# Altium schematic sheet GZ7_1_x-POWER.SchDoc: GZ8-4-0
size B; SheetNumber: 5; SheetTotal: 9
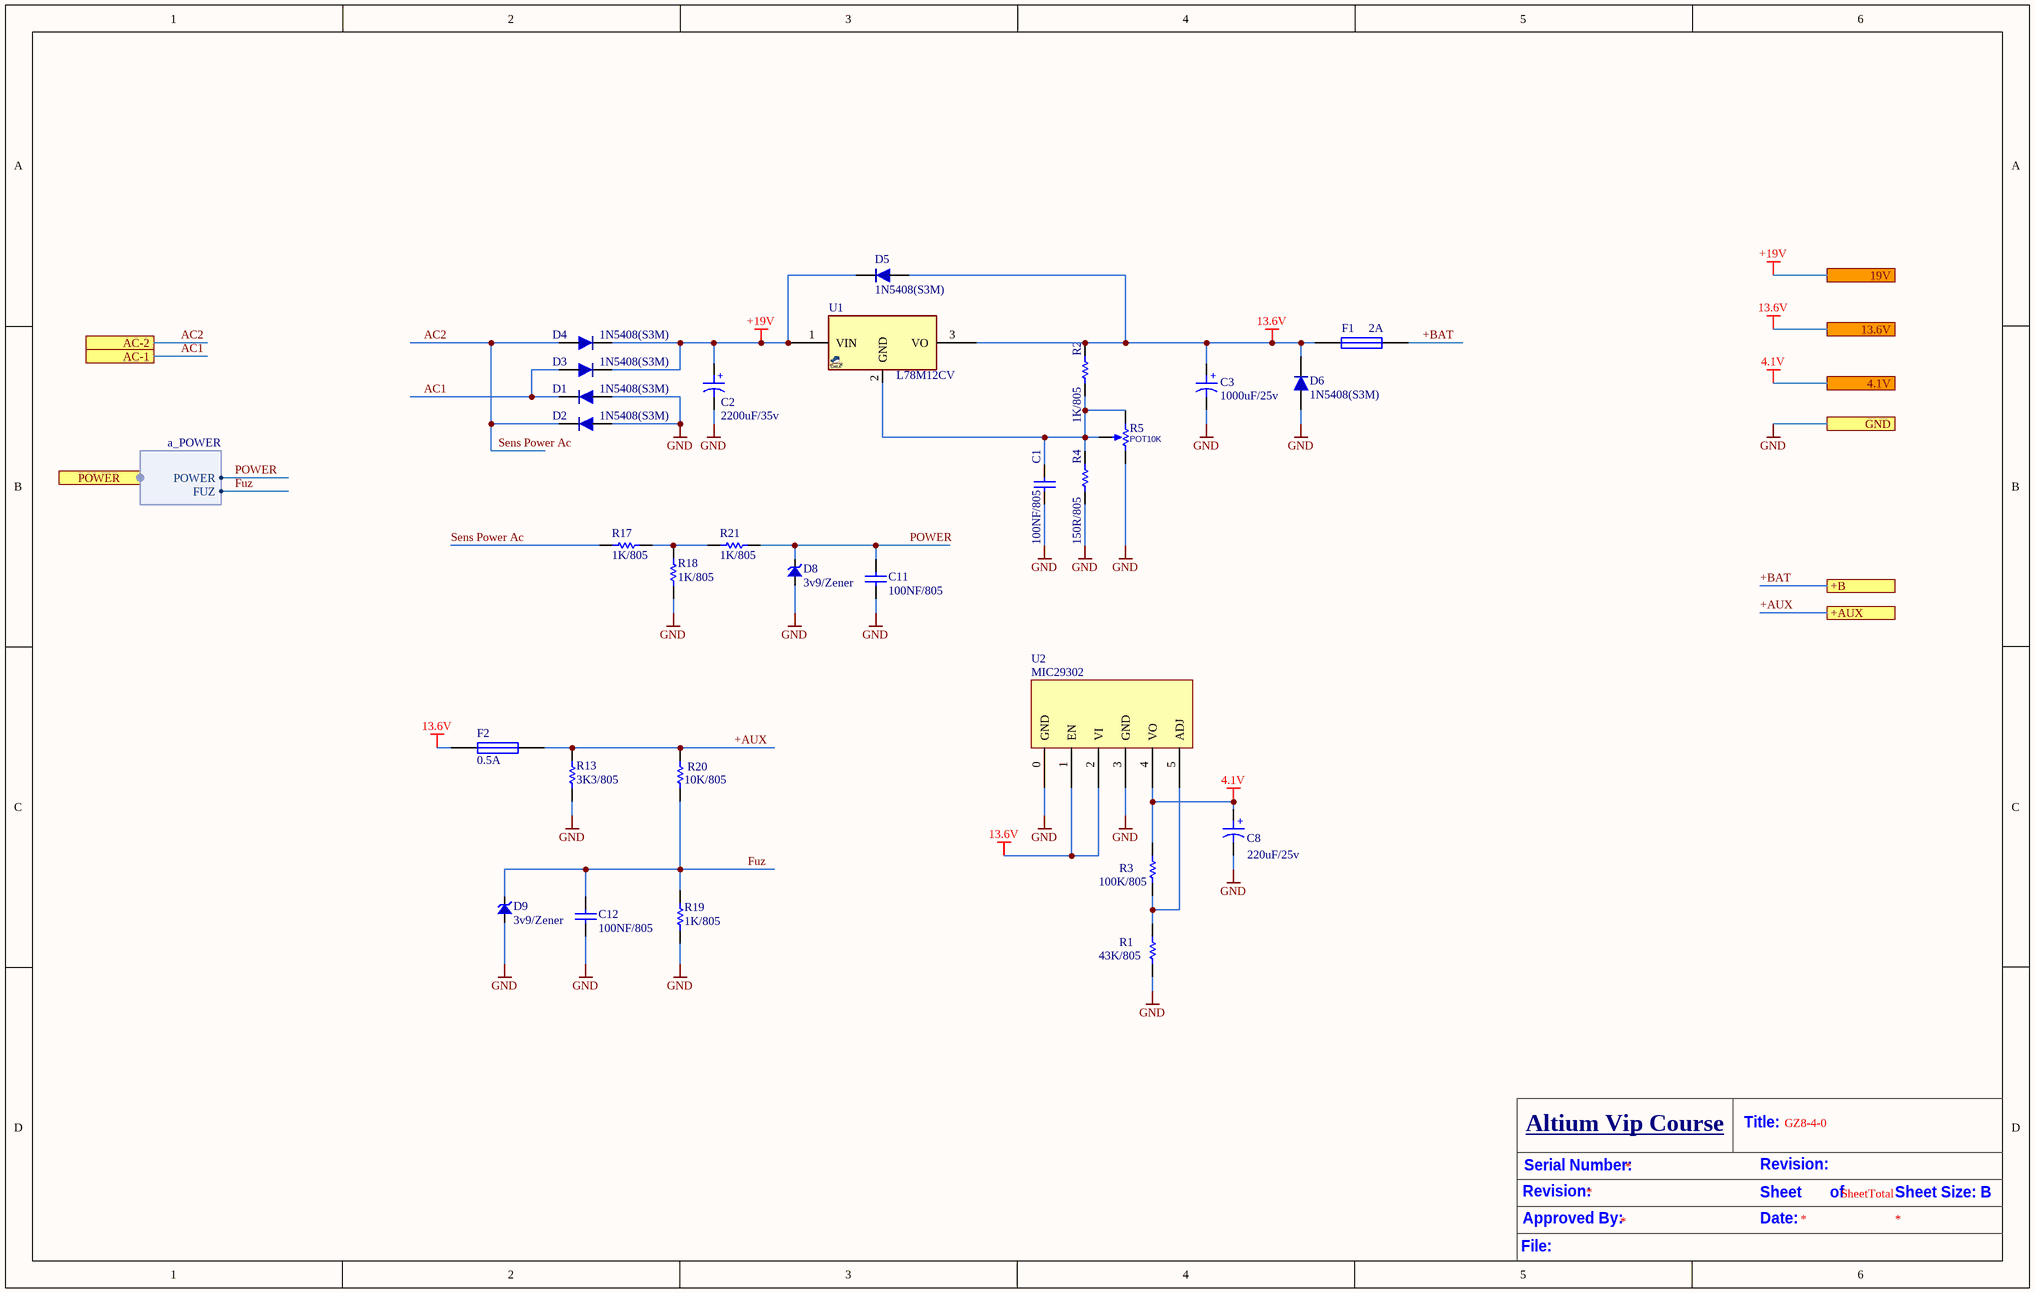
[diagram p0: GZ7_1_x-POWER.SchDoc]

## Parts
C1  100NF/805  [MY805 COP]
C2  2200uF/35v  [C_EL_10X16]
C3  1000uF/25v  [C_EL_10X16]
C8  220uF/25v  [C_EL_8X14]
C11  100NF/805  [MY805 COP]
C12  100NF/805  [MY805 COP]
D1  1N5408(S3M)  [DIOD_5408]
D2  1N5408(S3M)  [DIOD_5408]
D3  1N5408(S3M)  [DIOD_5408]
D4  1N5408(S3M)  [DIOD_5408]
D5  1N5408(S3M)  [DIOD_5408]
D6  1N5408(S3M)  [DIOD_5408]
D8  3v9/Zener  [my-DO5X.1.5]
D9  3v9/Zener  [my-DO5X.1.5]
F1  2A  [Fuse 5x20 With holder pin]
F2  0.5A  [Fuse 5x20 With holder pin]
R1  43K/805  [my805]
R2  1K/805  [my805]
R3  100K/805  [my805]
R4  150R/805  [my805]
R5  POT10K  [POT_7X5]
R13  3K3/805  [my805]
R17  1K/805  [my805]
R18  1K/805  [my805]
R19  1K/805  [my805]
R20  10K/805  [my805]
R21  1K/805  [my805]
U1  L78M12CV  [HSINK_TO220E]
U2  MIC29302  [my29302]

## Ports
4.1V, 13.6V, 19V, +AUX, +B, AC-1, AC-2, GND, POWER (harness a_POWER)

## Harnesses
a_POWER: POWER, FUZ

## Nets
4.1V: C8.1 R3.2 U2.4(VO) ; port 4.1V
13.6V: C3.1 D5.1 D6.2 F1.1 F2.1 R2.2 U1.3(VO) U2.1(EN) U2.2(VI) ; port 13.6V
+19V: C2.1 D3.2 D4.2 D5.2 U1.1(VIN) ; port 19V
GND: C1.1 C2.2 C3.2 C8.2 C11.1 C12.1 D1.1 D2.1 D6.1 D8.1 D9.1 R1.1 R4.1 R5.3(BOT) R13.1 R18.1 R19.1 U2.0(GND) U2.3(GND) ; port GND
+AUX: F2.2 R13.2 R20.2 ; port +AUX
+BAT: F1.2 ; port +B
AC1: D1.2 D3.1 ; port AC-1
AC2: D2.2 D4.1 R17.1 ; port AC-2  [also labelled Sens Power Ac]
Fuz: C12.2 D9.2 R19.2 R20.1 ; port POWER.FUZ
POWER: C11.2 D8.2 R21.2 ; port POWER.POWER
NetC1_2: C1.2 R2.1 R4.2 R5.1(TOP) R5.2(TAP) U1.2(GND)
NetR1_2: R1.2 R3.1 U2.5(ADJ)
NetR17_2: R17.2 R18.2 R21.1

## Notes on the sheet
- Serial Number:
- Altium Vip Course
- Title:
- Revision:
- Approved By:
- Date:
- Sheet       of
- SheetTotal
- Sheet Size: B
- File:
- (in symbol Cap electrolitic radial 10x21) +
- (in symbol Cap electrolitic radial 18x26) +

## Library data of the parts
C1 C11 C12 = CAP SMD 0805: CAP 0805; Designer: Abbas Basereh; Desc.: CAP SMD 0805; Data: 16-12-2016
C2 = Cap electrolitic radial 18x26: Cap electrolitic radial; Designer: Abbas Basereh; Value: 3300uF25V; Data: 16-12-2016
C3 = Cap electrolitic radial 18x26: Cap electrolitic radial; Designer: Abbas Basereh; Data: 16-12-2016
C8 = Cap electrolitic radial 10x21: Cap electrolitic radial
D1-D6 = 1N5819: Diode; Designer: Abbas Basereh; Data: 16-12-2016; Link: *; Part. No: *
D8 D9 = Zener
F1 F2 = FUSE1: Fuse
R1-R4 R13 R17-R21 = RES 1206 0.25W: RES 805; Designer: Abbas Basereh; Desc.: RES SMD 1206; Data: 16-12-2016
R5 = RES_THD_POT_7X5: RESISTOR, THD, Potentiometer; VALUE: POT10K
U1 = VREG_78M12_TO220: REG, Linear, Fixed, 12v, 1.5A, TO220; MANF_P#: L78M12CV, MC78M12CTG, UA78M12CKC; MANF: TI, ST, ON; PARAM: 12v, 1.5A; PARAM2: PARAM2; VALUE: L78M12CV
U2 = Component_1_1: PageSetup: 290302